# Altium schematic sheet Microphone.SchDoc
size A3; SheetNumber: 1; SheetTotal: 2
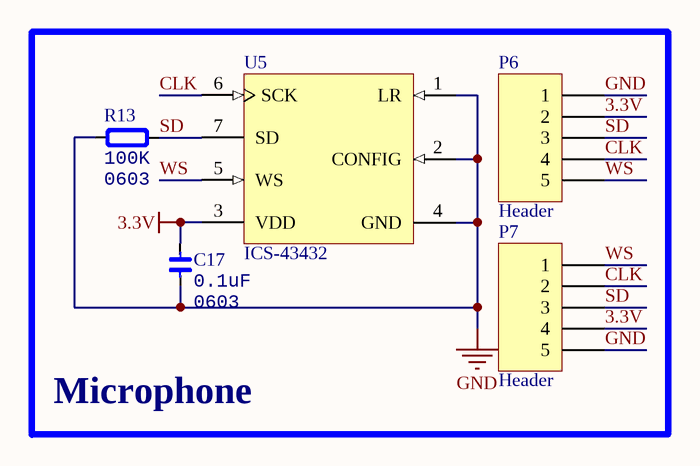
[diagram p0: Microphone.SchDoc]

## Parts
C17  value 0.1uF  Case/Package: 0603  [CAP_0603]  (hidden comment: C0603)
P6  Header  [ICS-43432 Pin]
P7  Header  [ICS-43432 Pin]
R13  value 100K  Case/Package: 0603  [RES_0603]  (hidden comment: R0402)
U5  ICS-43432  [INSE-ICS-43432_V]

## Blocks framed on the sheet
Microphone: C17 P6 P7 R13 U5

## Nets
3.3V: C17.2 P6.2 P7.4 U5.3(VDD)
GND: C17.1 P6.1 P7.5 R13.1 U5.1(LR) U5.2(CONFIG) U5.4(GND)
CLK: P6.4 P7.2 U5.6(SCK)
SD: P6.3 P7.3 R13.2 U5.7(SD)
WS: P6.5 P7.1 U5.5(WS)

## Library data of the parts
C17 = Cap_0603: Capacitor SMD; Specification: X7R 50V; Manufacturer: *; PartNumber: Capacitor; Note: *
P6 P7 = ICS-43432 Pin
R13 = Res_0603: Resistor SMD; Specification: ±1%; Manufacturer: *; PartNumber: Resistor; Note: *
U5 = CMP-2000-06439-1: Low Noise Microphone with I2S Digital Output, 1 mA, -40 to 85 degC, 7-Pin SMD, RoHS, Tape and Reel; Manufacturer: InvenSense; Sensitivity: -26dB±1dB@94dBSPL; Direction: Omnidirectional; Frequency Range: 50Hz~20kHz; Voltage Range: 1.62~3.63V; Shape: Rectangular; S/N Ratio: 65dB; Output Type: Digital,I²S; Seal Rating: None; Port Location: Bottom; Current - Supply: 1.5mA; Termination: SolderPads; Datasheet URL: https://www.invensense.com/wp-content/uploads/2015/02/ICS-43432-data-sheet-v1.3.pdf; Series: -; Size / Dimension: 4.00mmLx3.00mmW; Family: Microphones; Category: AudioProducts; Voltage - Rated: -; Impedance: -; Type: MEMS(Silicon); Packaging: Tape&amp;Reel(TR); Mounting Technology: SurfaceMount; Height (Max): 1.10mm; Package Reference: ICS-43432; Package Description: 7-Pin Surface Mount Device, Body 4 x 3 mm, Pitch 0.65 mm, Height 1.1 mm; Datasheet Version: Rev. 1.3, 04/2016; Manufacturer URL: http://www.invensense.com/